# Altium schematic sheet Stepper_driver_diff.SchDoc
size B; DocumentNumber: 10; SheetNumber: 10; SheetTotal: 13
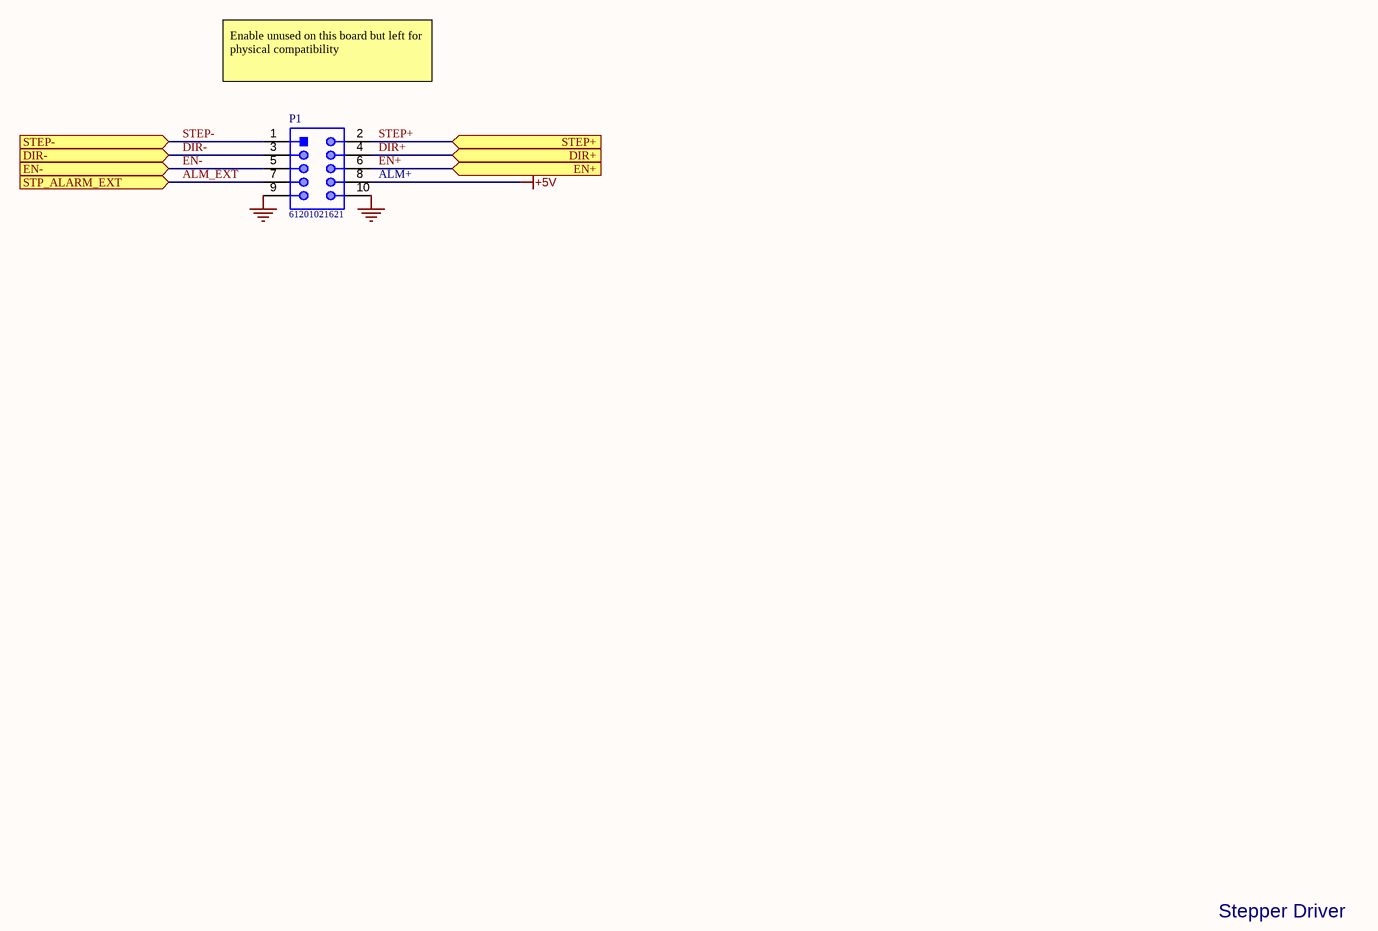
[diagram p0: Stepper_driver_diff.SchDoc]

## Parts
P1  61201021621  [61201021621]

## Ports
DIR+ (in), DIR- (in), EN+ (in), EN- (in), STEP+ (in), STEP- (in), STP_ALARM_EXT (in)

## Nets
+5V: P1.8
GND: P1.9 P1.10
ALM_EXT: P1.7 ; port STP_ALARM_EXT
DIR+: P1.4 ; port DIR+
DIR-: P1.3 ; port DIR-
EN+: P1.6 ; port EN+
EN-: P1.5 ; port EN-
STEP+: P1.2 ; port STEP+
STEP-: P1.1 ; port STEP-

## Notes on the sheet
- Enable unused on this board but left for physical compatibility
- (near P1) ALM+
- Stepper Driver
- SHEET
- Expatria Technologies
- 1136 Glade Court
- Port Coquitlam, BC V3B 1R5
- PHONE: (778) 238-9336
- PROJECT
- SIZE
- ENGR
- MODIFIED
- DOCUMENT
- REV
- This document contains confidential and proprietary information. No disclosure, reproduction, or transfer of this material in part or in its entirety shall be done without prior written approval.
- EMAIL: INFO@EXPATRIA.CA
- B
- /

## Library data of the parts
P1 = CMP-1502-00007-1: Male Box Header WR-BHD, THT, Vertical, pitch 2.54 mm, 10 pins; Manufacturer: Wurth Elektronik; Contact Resistance: 20mOhm; Withstanding Voltage: 500VAC; Pin Number: 10; Working Voltage: 250VAC; Pitch: 2.54mm; Mounting Technology: THT; Operating Temperature: -40to125degC; Published Date: August2018; Gender: Male; Packaging: Tray; Manufacturer URL: http://www.we-online.de; Datasheet URL: https://katalog.we-online.de/em/datasheet/6120xx21621.pdf; Orientation: Vertical; Package Reference: 61201021621; Part Number: 61201021621; Publisher: WurthElektronik